# Altium schematic sheet board_volt_sense.SchDoc
size A
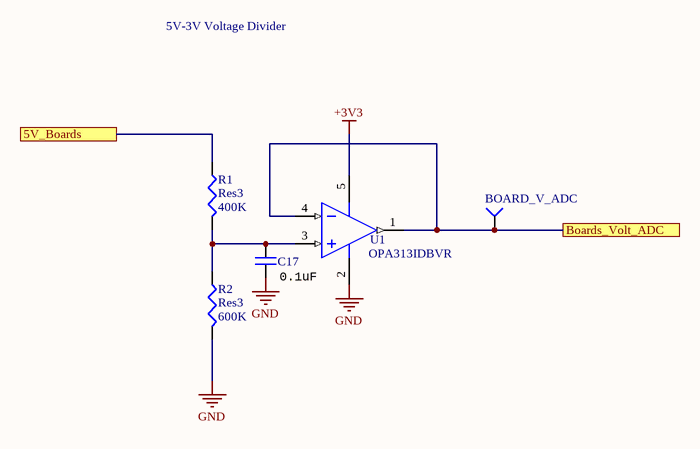
[diagram p0: board_volt_sense.SchDoc]

## Parts
BOARD_V_ADC  BOARD_V_ADC  [TESTPOINT]  (value not drawn)
C17  value 0.1uF  [CAPC0603(1608)55_N]
R1  Res3  value 400K  [J1-0603]
R2  Res3  value 600K  [J1-0603]
U1  OPA313IDBVR  [DBV0005A_M]

## Ports
5V_Boards, Boards_Volt_ADC

## Nets
+3V3: U1.5(V+)
GND: C17.1 R2.2 U1.2(V-)
5V_Boards: R1.1 ; port 5V_Boards
Boards_Volt_ADC: BOARD_V_ADC.1(=value) U1.1(OUT) U1.4(IN-) ; port Boards_Volt_ADC
NetC17_2: C17.2 R1.2 R2.1 U1.3(IN+)

## Notes on the sheet
- 5V-3V Voltage Divider

## Library data of the parts
BOARD_V_ADC = TESTPOINT_SMD: Part Number (MPN): *
C17 = CAP_0.1uF_16V_0603: CAP CER 0.1UF 16V X7R 0603; MPN: CC0603KRX7R7BB104; Manufacturer: Yageo; Dimensions: 0.063" L x 0.031" W (1.60mm x 0.80mm); Package: 0603 (1608 Metric); Temperature Coefficient: X7R; Voltage Rating: 16V; Digikey Part Number: 311-1088-1-ND
R1 R2 = Res3: Resistor; Published: 8-Jun-2000; LatestRevisionDate: 29-May-2009; LatestRevisionNote: IPC-7351 Footprint Added.; PackageReference: J1-0603; Publisher: Altium Limited; PackageDescription: Chip Resistor
U1 = OPAMP: 1-MHz, Micropower, Low-Noise, Rail-to-Rail I/O Operational Amplifier, 1.8 to 5.5 V, -40 to 125 degC, 5-pin SOT23 (DBV5), Green (RoHS & no Sb/Br); Manufacturer: Texas Instruments; Offset Drift(Typ)(uV/C): 2; Rating: Catalog; Packing: LARGE T&R; SubFamily: Low Input Bias Current Amp (<=10pA), Low Power Amp (<=500uA); Number of Channels: 1; Vio (25C)(Max)(mV): 2.5; Total Supply Voltage(Min)(+5V is 5, +/-5V is 10): 1.8; CMRR(Min)(dB): 70; Total Supply Voltage(Max)(+5V is 5, +/-5V is 10): 5.5; Iq per channel(Max)(mA): 0.06; Slew Rate(Typ)(V/us): 0.5; ComponentLink1Description: Manufacturer URL; PackageVersion: 4073253-4/K, 03/2006; ComponentLink2Description: Datasheet; Code_JEDEC: MO-178; GBW(Typ)(MHz): 1; Eco-Plan: Green (RoHS & no Sb/Br); ComponentLink3Description: Package Specification; PartNumber: OPA313IDBVR; PackageReference: DBV0005A; Mounting Technology: Surface Mount; PackageDescription: 5-Pin Plastic Small Outline, Body 1.6 x 2.9 mm, Pitch 0.95 mm; ComponentLink1URL: http://www.ti.com/; DatasheetVersion: SBOS649C; ComponentLink2URL: http://www.ti.com/lit/ds/symlink/opa313.pdf; ComponentLink3URL: http://www.ti.com/litv/pdf/mpds018i; Digi-Key Part Number: 296-35607-1-ND